# EAGLE design RF 2 (EAGLE 9.6.1)
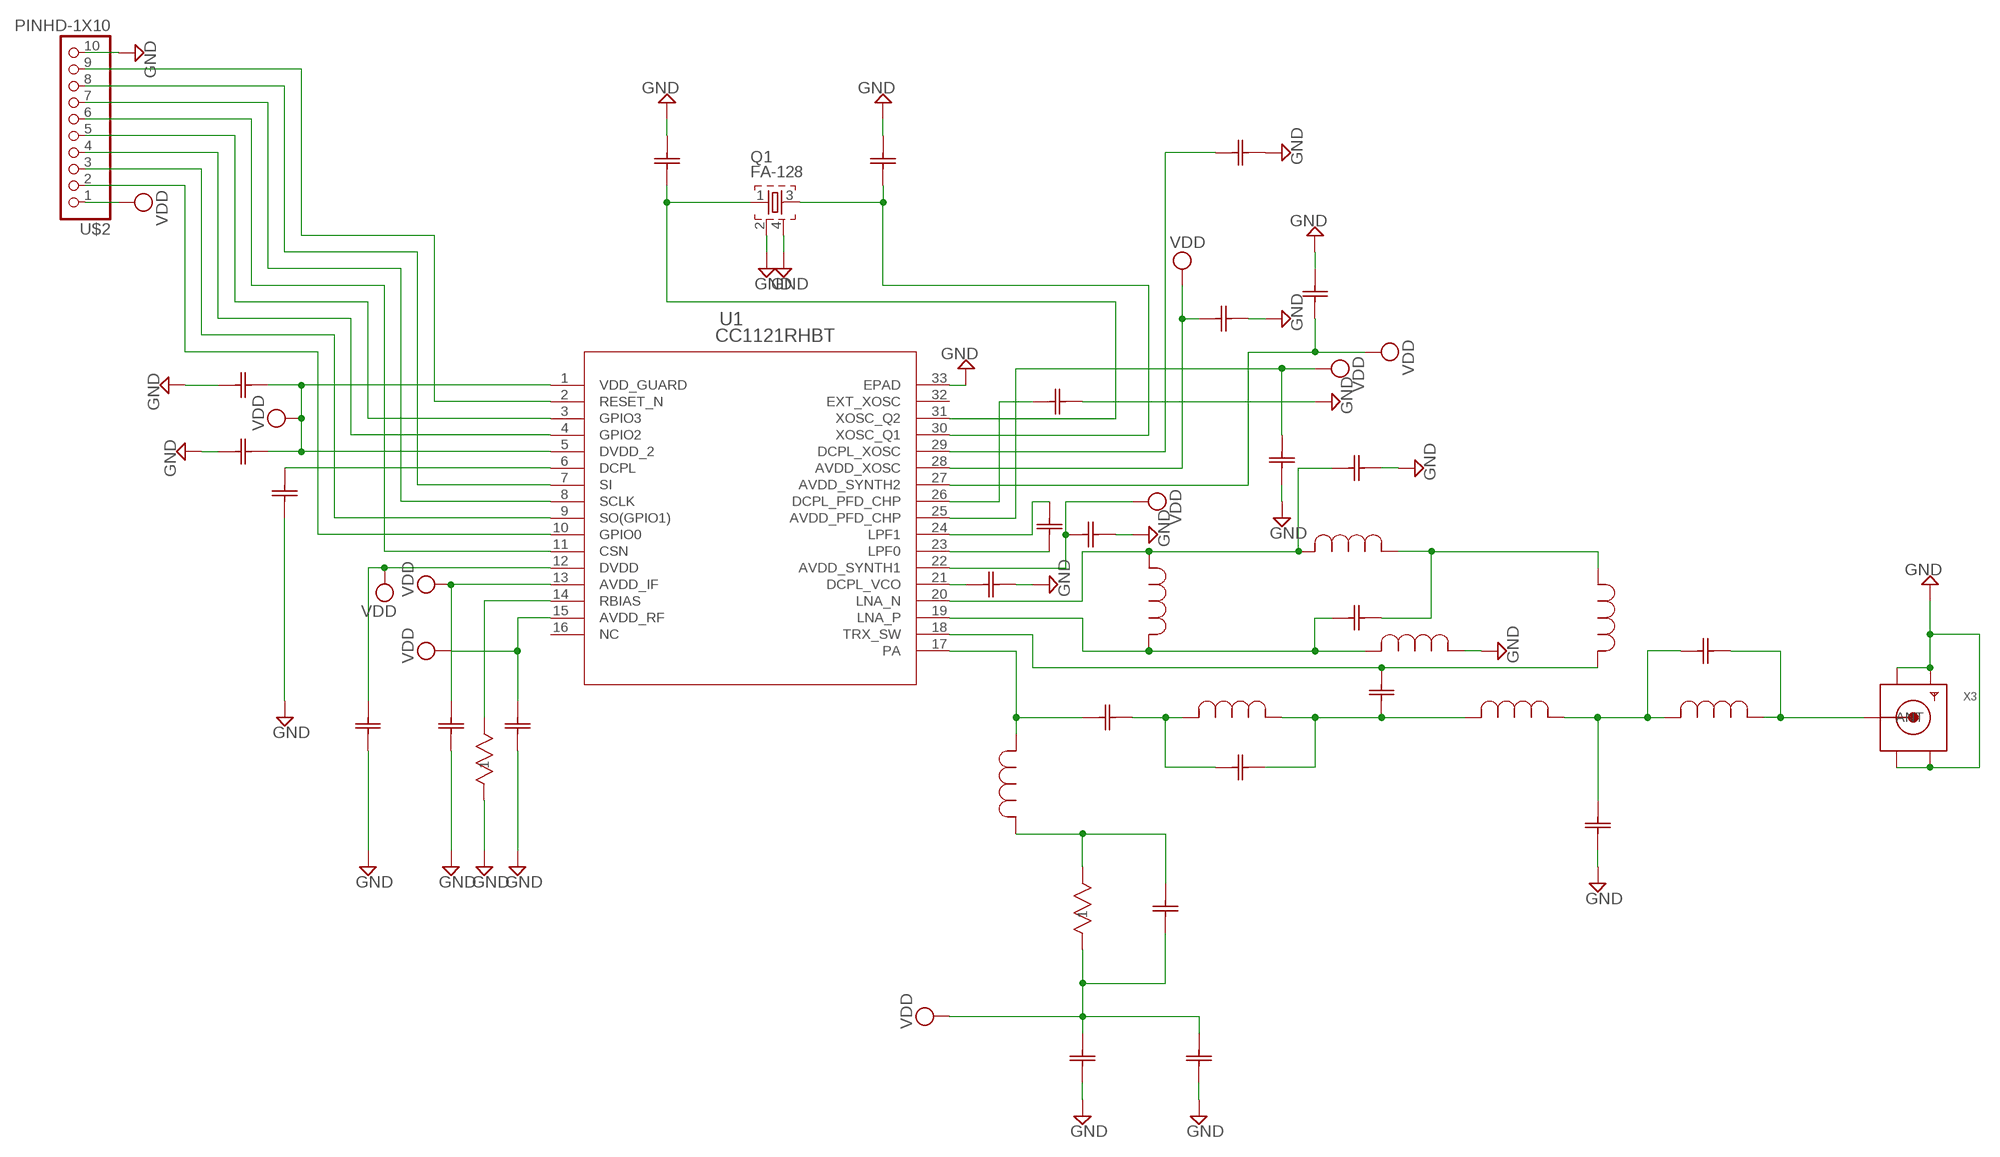
[diagram p0: schematic, sheet 1]

## Parts
C1  220nF  GRM155R71A104KA01D  [G-155_MUR]
C2  47nF  GRM155R71A104KA01D  [G-155_MUR]
C3  15pF  GRM155R71A104KA01D  [G-155_MUR]
C4  1pF  GRM155R71A104KA01D  [G-155_MUR]
C5  2.2pF  GRM155R71A104KA01D  [G-155_MUR]
C6  47nF  GRM155R71A104KA01D  [G-155_MUR]
C7  47nF  GRM155R71A104KA01D  [G-155_MUR]
C8  47nF  GRM155R71A104KA01D  [G-155_MUR]
C9  220nF  GRM155R71A104KA01D  [G-155_MUR]
C10  33pF  GRM155R71A104KA01D  [G-155_MUR]
C11  10pF  GRM155R71A104KA01D  [G-155_MUR]
C12  10pF  GRM155R71A104KA01D  [G-155_MUR]
C13  3pF  GRM155R71A104KA01D  [G-155_MUR]
C14  GRM155R71A104KA01D  [G-155_MUR]
C15  3.3pF  GRM155R71A104KA01D  [G-155_MUR]
C16  3.3pF  GRM155R71A104KA01D  [G-155_MUR]
C17  10nF  GRM155R71A104KA01D  [G-155_MUR]
C18  10nF  GRM155R71A104KA01D  [G-155_MUR]
C19  1.8nF  GRM155R71A104KA01D  [G-155_MUR]
C20  47nF  GRM155R71A104KA01D  [G-155_MUR]
C21  47nF  GRM155R71A104KA01D  [G-155_MUR]
C22  47nF  GRM155R71A104KA01D  [G-155_MUR]
C23  47nF  GRM155R71A104KA01D  [G-155_MUR]
C24  15pF  GRM155R71A104KA01D  [G-155_MUR]
C25  15pF  GRM155R71A104KA01D  [G-155_MUR]
C26  47nF  GRM155R71A104KA01D  [G-155_MUR]
L1  10nH  LQW15AN13NG00D  [IND_LQW15AN13NG00D_MUR]
L2  10nH  LQW15AN13NG00D  [IND_LQW15AN13NG00D_MUR]
L3  10nH  LQW15AN13NG00D  [IND_LQW15AN13NG00D_MUR]
L4  12nH  LQW15AN13NG00D  [IND_LQW15AN13NG00D_MUR]
L5  15nH  LQW15AN13NG00D  [IND_LQW15AN13NG00D_MUR]
L6  12nH  LQW15AN13NG00D  [IND_LQW15AN13NG00D_MUR]
L7  12nH  LQW15AN13NG00D  [IND_LQW15AN13NG00D_MUR]
L8  12nH  LQW15AN13NG00D  [IND_LQW15AN13NG00D_MUR]
Q1  FA-128  [FA-128]
R1  56k  RK73H1ETTP1003F  [RES_1E0402_1XP5_KOA]
R2  56k  RK73H1ETTP1003F  [RES_1E0402_1XP5_KOA]
U1  CC1121RHBT  [RHB32_3P45X3P45_TEX]
U$2  PINHD-1X10  [1X10-BIG]
X3  SMACONNECTOR_EDGE  [SMA_EDGELAUNCH]

## Nets
GND: C1.1 C2.1 C6.1 C7.1 C8.1 C9.1 C11.1 C12.1 C13.1 C16.2 C17.2 C18.2 C20.1 C21.2 C22.2 C23.2 C24.2 C25.2 C26.2 L8.1 Q1.2 Q1.4 R1.1 U1.33(EPAD) U$2.10 X3.GND@1(GND4) X3.GND@2(GND3) X3.GND@3(GND2) X3.GND@4(GND1)
N$1: U1.10(GPIO0) U$2.2
N$2: U1.9(SO(GPIO1)) U$2.3
N$3: U1.4(GPIO2) U$2.4
N$4: C9.2 U1.6(DCPL)
N$5: U1.3(GPIO3) U$2.5
N$6: U1.11(CSN) U$2.6
N$7: U1.8(SCLK) U$2.7
N$8: U1.7(SI) U$2.8
N$9: U1.2(RESET_N) U$2.9
N$10: R1.2 U1.14(RBIAS)
N$11: C3.1 L1.1 U1.17(PA)
N$12: C3.2 C4.1 L2.2
N$13: C5.2 L7.1 U1.18(TRX_SW)
N$14: C4.2 C5.1 L2.1 L3.2
N$15: C10.2 L1.2 R2.2
N$16: C15.2 L6.1 L7.2
N$17: C13.2 C14.1 L3.1 L4.2
N$18: C17.1 U1.21(DCPL_VCO)
N$19: C14.2 L4.1 X3.P(ANT)
N$20: C15.1 L5.1 L8.2 U1.19(LNA_P)
N$21: C16.1 L5.2 L6.2 U1.20(LNA_N)
N$22: C19.1 U1.23(LPF0)
N$23: C19.2 U1.24(LPF1)
N$24: C26.1 U1.29(DCPL_XOSC)
N$25: C21.1 U1.26(DCPL_PFD_CHP)
N$26: C25.1 Q1.3 U1.30(XOSC_Q1)
N$27: C24.1 Q1.1 U1.31(XOSC_Q2)
VDD: C1.2 C2.2 C6.2 C7.2 C8.2 C10.1 C11.2 C12.2 C18.1 C20.2 C22.1 C23.1 R2.1 U1.1(VDD_GUARD) U1.5(DVDD_2) U1.12(DVDD) U1.13(AVDD_IF) U1.15(AVDD_RF) U1.22(AVDD_SYNTH1) U1.25(AVDD_PFD_CHP) U1.27(AVDD_SYNTH2) U1.28(AVDD_XOSC) U$2.1
Unconnected: U1.16(NC) U1.32(EXT_XOSC)

## Library data of the parts
C1-C26 = GRM155R71A104KA01D:GRM155R71A104KA01D; COPYRIGHT: Copyright (C) 2015 Accelerated Designs. All rights reserved; MANUFACTURER_PART_NUMBER: GRM155R71A104KA01D; SOURCELIBRARY: Murata_2014-12-31; VENDOR: Murata
L1-L8 = LQW15AN10NJ00D:LQW15AN13NG00D; BUILT_BY: EMA_Cory; COPYRIGHT: Copyright (C) 2018 Accelerated Designs. All rights reserved; DATASHEET: https://search.murata.co.jp/Ceramy/image/img/P02/JELF243A-0050.pdf; MANUFACTURER_PART_NUMBER: LQW15AN13NG00D; SOURCELIBRARY: Murata_2020-09-02; VENDOR: Murata
Q1 = crystal:FA-: MHz RANGE CRYSTAL UNIT Source: Epson Toyocom
R1 R2 = RK37H1ETTP5602F:RK73H1ETTP1003F; BUILT_BY: EMA_Anthony; COPYRIGHT: Copyright (C) 2018 Accelerated Designs. All rights reserved; DATASHEET: http://www.koaspeer.com/pdfs/RK73H.pdf; MANUFACTURER_PART_NUMBER: RK73H1ETTP1003F; SOURCELIBRARY: KOA_Speer_2020-02-20; VENDOR: KOA Speer
U1 = CC1121 RF:CC1121RHBT; BUILT_BY: EMA_UL_Team; MANUFACTURER_PART_NUMBER: CC1121RHBT; SOURCELIBRARY: TI_2016-08-12; VENDOR: Texas Instruments
U$2 = adafruit:PINHD-1X10: Pin header 1x10 0.1" spacing With round pins
X3 = adafruit:SMACONNECTOR: SMA Connector 90° DIP SMA Connector, 50 Ohm (4UConnector: 07259)

## Board
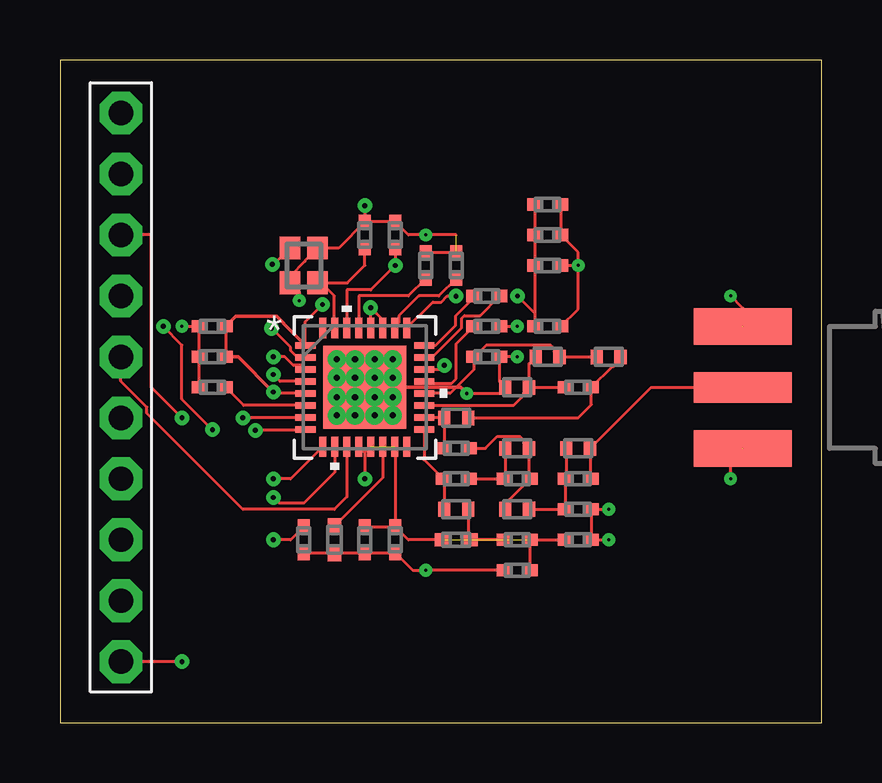
[diagram p1: board, top side]
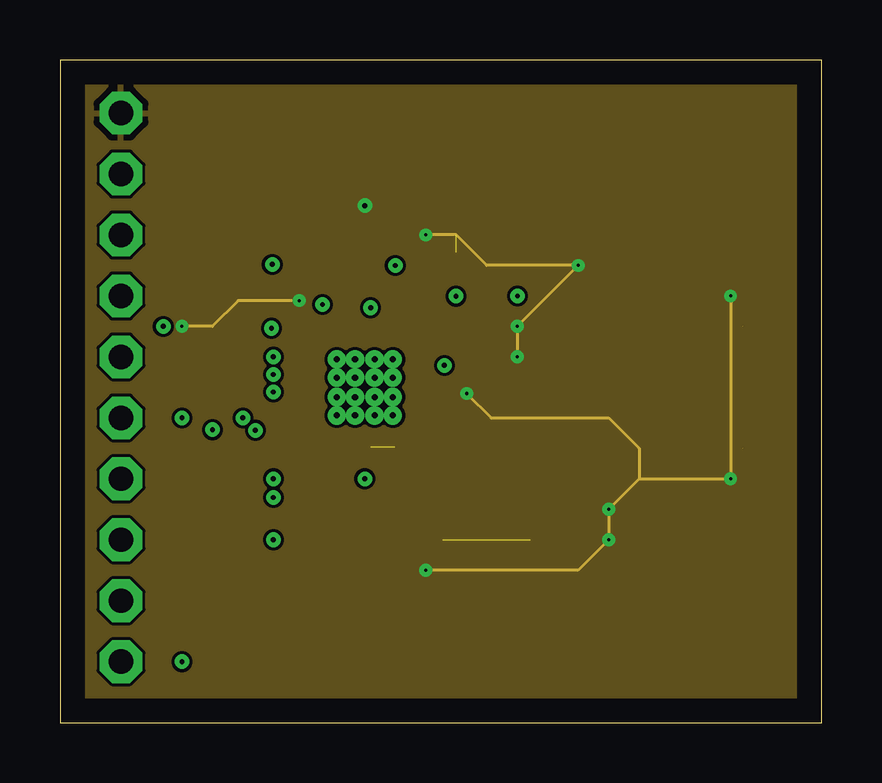
[diagram p2: board, inner layer GND]
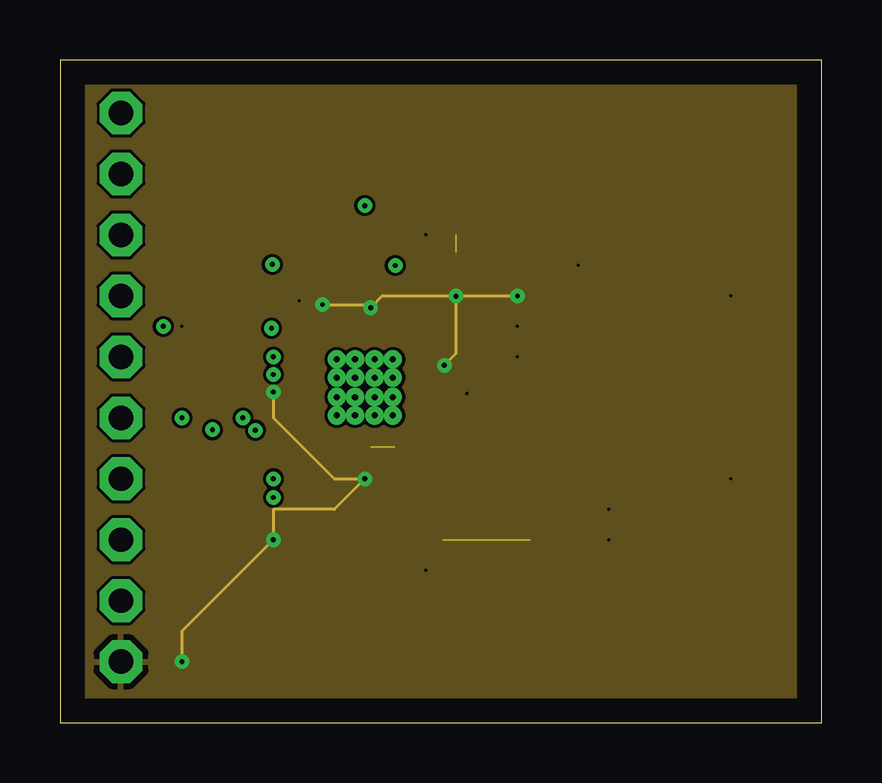
[diagram p3: board, inner layer VDD]
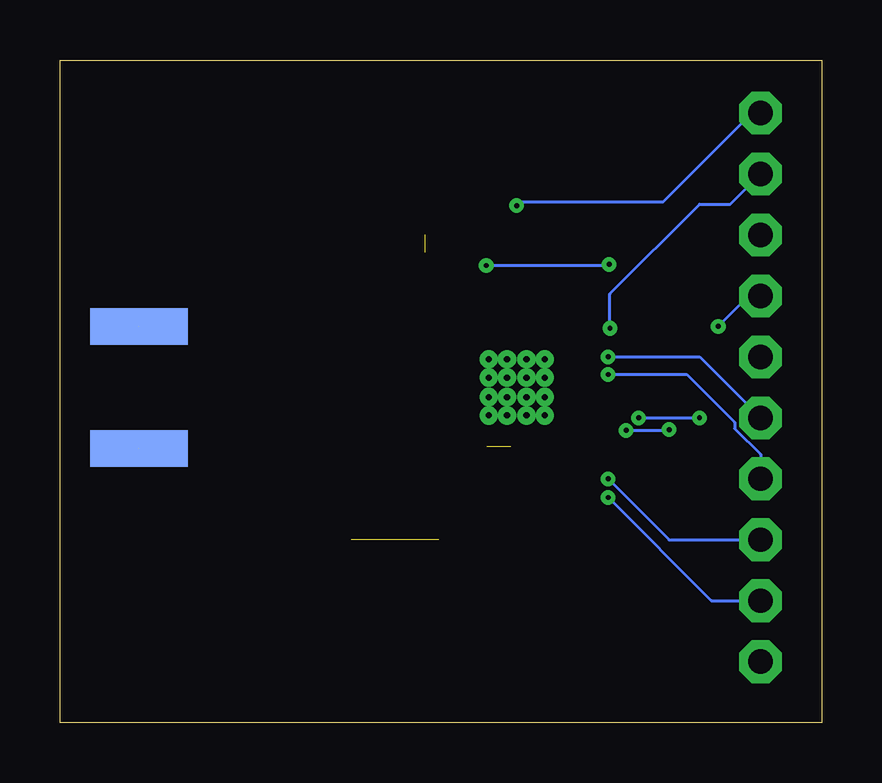
[diagram p4: board, bottom side, seen from below]

Size 31.73 x 27.61 mm. Coordinates in mm from the lower left corner, seen from the top.
Outline: 0,0 31.73,0 31.73,27.61 0,27.61 0,0
Copper layers ([2:[15:1+2*15+16]]): Top 0.035559375mm / dielectric 0.17018125mm / GND 0.01778125mm / dielectric 47mil / VDD 0.01778125mm / dielectric 0.17018125mm / Bottom 0.035559375mm
Design rules "default *": minimum track width 5mil, minimum drill 6mil, track to track 5mil, track to pad 5mil, pad to pad 5mil, via to via 5mil, smd to smd 5mil, copper to edge 40mil, drill to drill 6mil, minimum pad ring 10mil, minimum via ring 8mil, stop-mask expansion 4mil, vias tented up to drill 0mil, thermal gap 10mil

### Footprints (pad centres in the part's own frame; a part is rotated, then mirrored left to right if it is on the bottom)
G-155_MUR = smd 0.61 x 0.508: 1 -0.546,0; 2 0.546,0
IND_LQW15AN13NG00D_MUR = smd 0.508 x 0.61: 1 -0.495,0; 2 0.495,0
FA-128 = smd 0.95 x 0.85: 1 -0.725,-0.575; 2 0.725,-0.575; 3 0.725,0.575; 4 -0.725,0.575
RES_1E0402_1XP5_KOA = smd 0.66 x 0.559: 1 -0.572,0; 2 0.572,0
RHB32_3P45X3P45_TEX = smd 0.85 x 0.28: 1 -2.475,1.75; 2 -2.475,1.25; 3 -2.475,0.75; 4 -2.475,0.25; 5 -2.475,-0.25; 6 -2.475,-0.75; 7 -2.475,-1.25; 8 -2.475,-1.75; 17 2.475,-1.75; 18 2.475,-1.25; 19 2.475,-0.75; 20 2.475,-0.25; 21 2.475,0.25; 22 2.475,0.75; 23 2.475,1.25; 24 2.475,1.75 | smd 0.28 x 0.85: 9 -1.75,-2.475; 10 -1.25,-2.475; 11 -0.75,-2.475; 12 -0.25,-2.475; 13 0.25,-2.475; 14 0.75,-2.475; 15 1.25,-2.475; 16 1.75,-2.475; 25 1.75,2.475; 26 1.25,2.475; 27 0.75,2.475; 28 0.25,2.475; 29 -0.25,2.475; 30 -0.75,2.475; 31 -1.25,2.475; 32 -1.75,2.475 | smd 3.45 x 3.45: 33 0,0 | drill 0.254 pad 0.508: V -1.168,-1.168; V_1 -1.168,-0.406; V_2 -1.168,0.406; V_3 -1.168,1.168; V_4 -0.406,-1.168; V_5 -0.406,-0.406; V_6 -0.406,0.406; V_7 -0.406,1.168; V_8 0.406,-1.168; V_9 0.406,-0.406; V_10 0.406,0.406; V_11 0.406,1.168; V_12 1.168,-1.168; V_13 1.168,-0.406; V_14 1.168,0.406; V_15 1.168,1.168
1X10-BIG = drill 1.016 pad 1.778 octagon: 1 -11.43,0; 2 -8.89,0; 3 -6.35,0; 4 -3.81,0; 5 -1.27,0; 6 1.27,0; 7 3.81,0; 8 6.35,0; 9 8.89,0; 10 11.43,0
SMA_EDGELAUNCH = smd 4.064 x 1.524: GND@1 2.032,-2.54; GND@2 2.032,2.54 | smd 4.064 x 1.524 bottom: GND@3 2.032,2.54; GND@4 2.032,-2.54 | smd 4.064 x 1.27: P 2.032,0

### Placement (x,y rotation side)
C1  6.35,15.24 0 top
C2  13.97,7.62 90 top
C3  16.51,10.16 0 top
C4  19.05,10.16 0 top
C5  16.51,11.43 180 top
C6  6.35,16.51 0 top
C7  10.16,7.62 90 top
C8  12.7,7.62 90 top
C9  6.35,13.97 0 top
C10  19.05,7.62 180 top
C11  19.05,6.35 0 top
C12  21.59,7.62 180 top
C13  21.59,8.89 180 top
C14  21.59,10.16 0 top
C15  21.59,13.97 0 top
C16  17.78,15.24 0 top
C17  17.78,16.51 0 top
C18  20.32,16.51 0 top
C19  17.78,17.78 180 top
C20  20.32,19.05 180 top
C21  16.51,19.05 90 top
C22  20.32,20.32 0 top
C23  20.32,21.59 0 top
C24  12.7,20.32 90 top
C25  13.97,20.32 90 top
C26  15.24,19.05 90 top
L1  16.51,8.89 0 top
L2  19.05,11.43 180 top
L3  19.05,8.89 180 top
L4  21.59,11.43 180 top
L5  20.32,15.24 0 top
L6  22.86,15.24 180 top
L7  16.51,12.7 0 top
L8  19.05,13.97 0 top
Q1  10.16,19.05 90 top
R1  11.43,7.62 90 top
R2  16.51,7.62 0 top
U1  12.7,13.97 0 top
U$2  2.54,13.97 90 top
X3  30.48,13.97 180 top

### Tracks (layer width: path | path; a pad name or v marks a point on that pad's centre or on a via)
GND  (via drill 0.13 layers 1-2, 0.2)  (3 unrouted)
  Top 0.127: v22.86,8.89 C13.1 C12.1 v22.86,7.62 | v27.94,10.16 27.94,10.92 X3.GND@3 | X3.GND@4 28.45,17.27 v27.94,17.78 | C17.2 v19.05,16.51 | v19.05,15.24 C16.2 18.33,14.2 L8.1 18.3,13.71 v16.95,13.71 | v21.59,19.05 21.59,19.6 C22.2 C23.2 | C20.1 v21.59,19.05 | C18.2 21.59,17.23 v21.59,19.05 | C11.1 v15.24,6.35 14.69,6.35 C2.1 C8.1 11.45,7.07 R1.1 11.41,7.07 C7.1 | C26.2 C21.2 | C24.2 C25.2 14.52,20.32 v15.24,20.32 16.51,20.32 | C24.2 11.61,19.78 Q1.2 10.2,19.24 10.2,19.22 9.59,18.61 Q1.4 9.97,17.94 v9.97,17.59 | v5.08,16.51 C6.1 C1.1 C9.1 | U1.33 | v12.7,21.54 C24.2
  Top 0.152: U1.33 16.7,13.97 v16.95,13.71
  GND 0.127: 24.13,10.16 v22.86,8.89 v22.86,7.62 21.59,6.35 v15.24,6.35 | 24.13,10.16 v27.94,10.16 v27.94,17.78 | v19.05,15.24 v19.05,16.51 v21.59,19.05 17.78,19.05 16.51,20.32 v15.24,20.32 | v9.97,17.59 7.43,17.59 6.35,16.51 v5.08,16.51 | v16.95,13.71 17.97,12.7 22.86,12.7 24.13,11.43 24.13,10.16
  Bottom 0.127: U$2.10 2.9,25.4 6.61,21.69 12.55,21.69 v12.7,21.54
  pour GND: -2.54,33.02 -2.54,-3.81 34.29,-3.81 34.29,33.02
N$1  (via drill 0.2)
  Top 0.127: U1.10 11.45,10.43 10.16,9.14 9.13,9.14 v8.89,9.38
  Bottom 0.127: v8.89,9.38 4.59,5.08 U$2.2
N$2  (via drill 0.2)
  Top 0.127: U1.9 9.62,10.16 v8.89,10.16
  Bottom 0.127: v8.89,10.16 6.35,7.62 U$2.3
N$3  (via drill 0.2)
  Top 0.127: U1.4 9.18,14.22 v8.89,14.51
  Bottom 0.127: v8.89,14.51 5.62,14.51 3.62,12.51 3.62,12.25 2.54,11.17 U$2.4
N$4
  Top 0.127: U1.6 7.65,13.22 C9.2
N$5  (via drill 0.2)
  Top 0.127: U1.3 10.05,14.89 9.72,14.89 9.37,15.24 v8.89,15.24
  Bottom 0.127: v8.89,15.24 5.08,15.24 U$2.5
N$6
  Top 0.127: U1.11 11.95,9.41 11.43,8.89 7.62,8.89 3.62,12.89 3.62,13.15 2.54,14.23 U$2.6
N$7  (via drill 0.2)
  Top 0.127: U1.8 10.19,12.18 v8.14,12.18 | v6.35,12.21 5.08,13.48 5.08,15.73 v4.3,16.51
  Bottom 0.127: v8.14,12.18 6.38,12.18 v6.35,12.21 | v4.3,16.51 3.03,17.78 U$2.7
N$8  (via drill 0.2)
  Top 0.127: U1.7 10.2,12.7 v7.62,12.7 | v5.08,12.7 3.81,13.97 3.81,20.32 U$2.8
  Bottom 0.127: v7.62,12.7 v5.08,12.7
N$9  (via drill 0.2)
  Top 0.127: v8.81,16.43 9.61,15.64 9.61,15.5 9.89,15.22 U1.2
  Bottom 0.127: U$2.9 3.81,21.59 5.08,21.59 5.08,21.6 8.81,17.87 v8.81,16.43
N$10
  Top 0.127: U1.14 13.45,10.21 R1.2
N$11
  Top 0.127: U1.17 15.17,10.95 C3.1 16.02,10.11 L1.1
N$12
  Top 0.127: C3.2 C4.1 18.55,10.21 L2.2
N$13
  Top 0.127: U1.18 15.99,12.72 L7.1 16.02,11.48 C5.2
N$14
  Top 0.127: L3.2 18.55,9.12 C4.2 19.55,10.21 L2.1 19.32,11.66 19.32,11.77 19.16,11.93 18.22,11.93 17.73,11.43 C5.1
N$15
  Top 0.127: L1.2 17.01,7.7 R2.2 C10.2
N$16
  Top 0.127: L7.2 21.59,12.7 22.14,13.25 C15.2 23.02,14.86 23.08,14.86 23.35,15.13 L6.1
N$17
  Top 0.127: L3.1 C13.2 C14.1 21.09,10.21 L4.2
N$18
  Top 0.127: U1.21 15.24,14.15 16.33,14.15 16.51,14.33 16.51,15.79 C17.1
N$19
  Top 0.127: C14.2 22.09,10.21 L4.1 24.62,13.97 X3.P
N$20
  Top 0.127: L8.2 19.32,13.74 19.32,13.63 18.9,13.22 U1.19 | L8.2 19.55,14.96 L5.1 | L8.2 C15.1
N$21
  Top 0.127: 17.03,15.24 C16.1 | L6.2 L5.2 20.59,15.47 20.59,15.58 20.43,15.73 17.77,15.73 17.28,15.24 C16.1 | C16.1 17.23,14.69 16.26,13.72 U1.20
N$22
  Top 0.127: C19.1 17.5,16.96 16.85,16.96 16.74,16.84 16.74,16.45 15.51,15.22 U1.23
N$23
  Top 0.127: U1.24 15.65,15.72 16.48,16.55 16.48,16.95 17.23,17.7 C19.2
N$24
  Top 0.127: C26.1 14.52,17.78 12.45,17.78 U1.29
N$25
  Top 0.127: 13.95,16.78 13.95,16.51 | 13.95,16.51 U1.26 | C21.1 15.79,17.78 14.95,17.78 14.12,16.95 14.12,16.68 13.95,16.51
N$26  (via drill 0.2)
  Top 0.127: C25.1 v13.97,19.05 12.95,18.03 11.95,18.03 U1.30 | v8.85,19.09 8.9,19.09 Q1.3
  Bottom 0.127: v13.97,19.05 8.89,19.05 v8.85,19.09
N$27
  Top 0.127: C24.1 12.7,19.05 11.98,18.32 Q1.1 10.88,18.32 11.43,17.78 11.43,16.46 U1.31
VDD  (via drill 0.2 layers 1-15)  (2 unrouted)
  Top 0.127: C12.2 C10.1 C11.2 | C23.1 C22.1 C20.2 C18.1 19.77,17.07 v19.06,17.78 | 15.79,7.62 R2.1 14.52,7.62 C2.2 | v5.08,2.54 U$2.1 | C7.2 9.61,7.62 v8.89,7.62 | U1.15 13.97,11.47 C2.2 | C8.2 C2.2 | U1.25 15.53,17.53 15.89,17.53 16.14,17.78 v16.51,17.78 v16.5,17.77 | U1.22 15.85,14.72 v16.02,14.89 | 6.92,16.54 C6.2 C1.2 | U1.28 v12.95,17.28 | v12.95,17.28 v12.94,17.29 | U1.27 13.45,16.78 v12.95,17.28 | U1.1 10.23,16.71 v10.94,17.42 | U1.13 12.7,11.25 | U1.12 12.7,11.25 | 12.7,11.25 v12.7,10.16 | U1.5 8.94,13.72 v8.89,13.77
  Top 0.152: v8.89,13.77 7.42,15.24 C1.2 | U1.1 9.32,16.62 9.32,16.64 9.02,16.94 7.33,16.94 6.92,16.54
  VDD 0.127: v5.08,2.54 5.08,3.81 v8.89,7.62 8.89,8.89 11.43,8.89 v12.7,10.16 11.43,10.16 8.89,12.7 v8.89,13.77 | v16.5,17.77 v16.51,17.78 | v16.51,17.78 v19.06,17.78 | v16.02,14.89 16.51,15.38 v16.51,17.78 | v16.51,17.78 13.44,17.78 v12.94,17.29 12.81,17.42 v10.94,17.42
  pour VDD: -1.27,-2.54 33.02,-2.54 33.02,31.75 -1.27,31.75